# Altium schematic sheet LineSensors.SchDoc
size A; SheetNumber: roneV11-GyroAccel; SheetTotal: 6
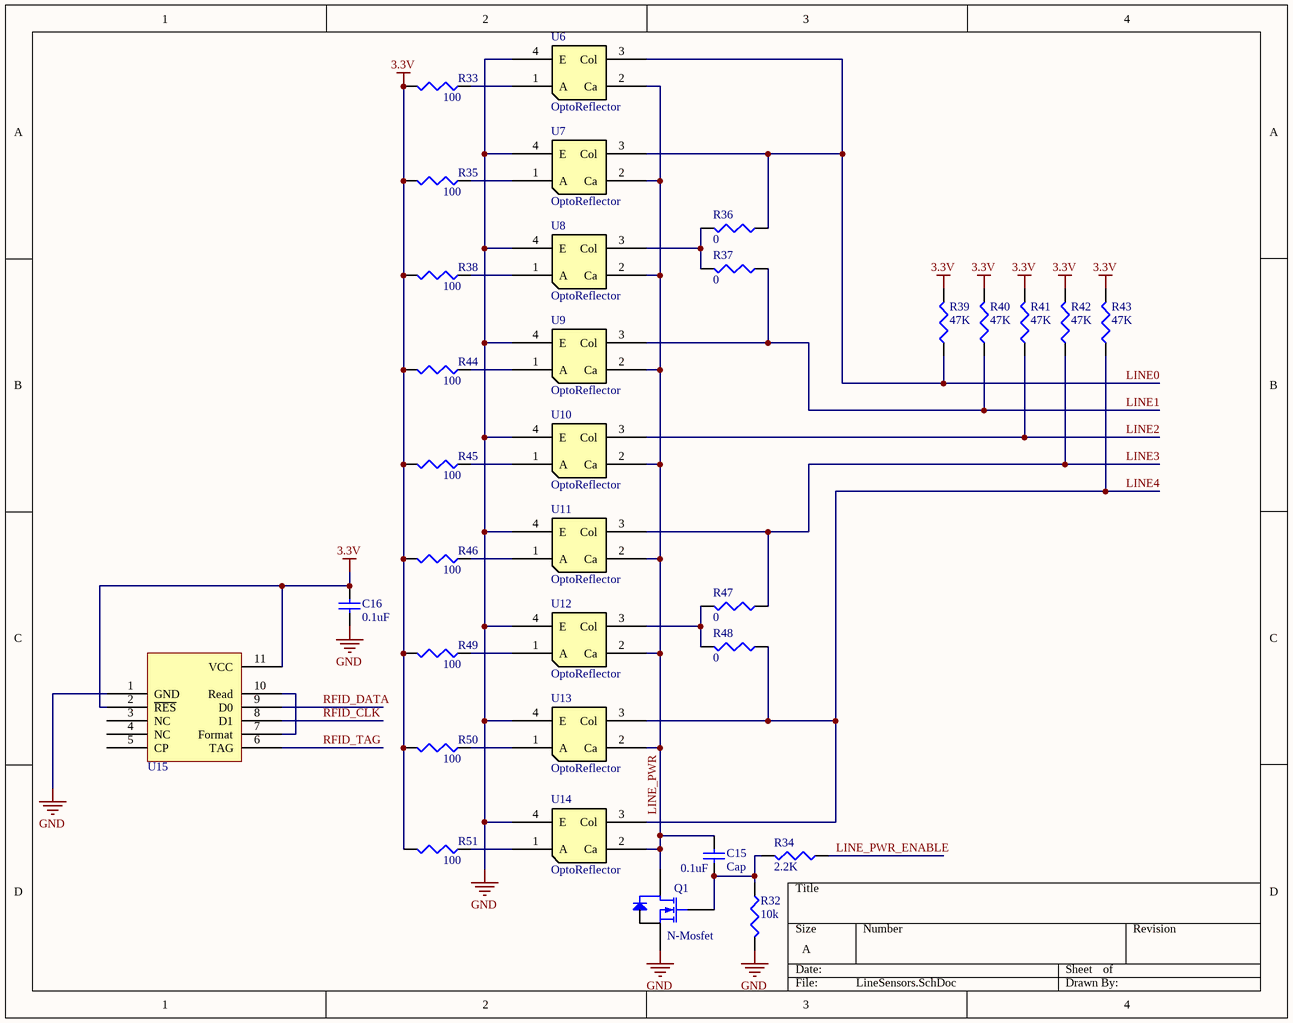
[diagram p0: LineSensors.SchDoc]

## Parts
C15  Cap  value 0.1uF  [CAPC1005L]
C16  value 0.1uF  [CAPC1005L]  (hidden comment: Cap Semi)
Q1  N-Mosfet  [SOT-23]
R32  value 10k  [J1-0603]  (hidden comment: Res3)
R33  value 100  [J1-0603]  (hidden comment: Res3)
R34  value 2.2K  [J1-0603]  (hidden comment: Res3)
R35  value 100  [J1-0603]  (hidden comment: Res3)
R36  value 0  [J1-0603]  (hidden comment: Res3)
R37  value 0  [J1-0603]  (hidden comment: Res3)
R38  value 100  [J1-0603]  (hidden comment: Res3)
R39  value 47K  [J1-0603]  (hidden comment: Res3)
R40  value 47K  [J1-0603]  (hidden comment: Res3)
R41  value 47K  [J1-0603]  (hidden comment: Res3)
R42  value 47K  [J1-0603]  (hidden comment: Res3)
R43  value 47K  [J1-0603]  (hidden comment: Res3)
R44  value 100  [J1-0603]  (hidden comment: Res3)
R45  value 100  [J1-0603]  (hidden comment: Res3)
R46  value 100  [J1-0603]  (hidden comment: Res3)
R47  value 0  [J1-0603]  (hidden comment: Res3)
R48  value 0  [J1-0603]  (hidden comment: Res3)
R49  value 100  [J1-0603]  (hidden comment: Res3)
R50  value 100  [J1-0603]  (hidden comment: Res3)
R51  value 100  [J1-0603]  (hidden comment: Res3)
U6  OptoReflector  [QRE1113]
U7  OptoReflector  [QRE1113]
U8  OptoReflector  [QRE1113]
U9  OptoReflector  [QRE1113]
U10  OptoReflector  [QRE1113]
U11  OptoReflector  [QRE1113]
U12  OptoReflector  [QRE1113]
U13  OptoReflector  [QRE1113]
U14  OptoReflector  [QRE1113]
U15  ID-12LA  [ID12-LA]  (value not drawn)

## Nets
3.3V: C16.2 R33.2 R35.2 R38.2 R39.2 R40.2 R41.2 R42.2 R43.2 R44.2 R45.2 R46.2 R49.2 R50.2 R51.2 U15.2(~{RES}) U15.11(VCC)
GND: C16.1 Q1.2(S) R32.1 U6.4(E) U7.4(E) U8.4(E) U9.4(E) U10.4(E) U11.4(E) U12.4(E) U13.4(E) U14.4(E) U15.1(GND)
LINE0: R36.1 R39.1 U6.3(Col) U7.3(Col)
LINE1: R37.1 R40.1 U9.3(Col)
LINE2: R41.1 U10.3(Col)
LINE3: R42.1 R47.1 U11.3(Col)
LINE4: R43.1 R48.1 U13.3(Col) U14.3(Col)
LINE_PWR: C15.1 Q1.3(D) U6.2(Ca) U7.2(Ca) U8.2(Ca) U9.2(Ca) U10.2(Ca) U11.2(Ca) U12.2(Ca) U13.2(Ca) U14.2(Ca)
LINE_PWR_ENABLE: R34.2
RFID_CLK: U15.8(D1)
RFID_DATA: U15.9(D0)
RFID_TAG: U15.6(TAG)
NetC15_2: C15.2 Q1.1(G) R32.2 R34.1
NetR33_1: R33.1 U6.1(A)
NetR35_1: R35.1 U7.1(A)
NetR36_2: R36.2 R37.2 U8.3(Col)
NetR38_1: R38.1 U8.1(A)
NetR44_1: R44.1 U9.1(A)
NetR45_1: R45.1 U10.1(A)
NetR46_1: R46.1 U11.1(A)
NetR47_2: R47.2 R48.2 U12.3(Col)
NetR49_1: R49.1 U12.1(A)
NetR50_1: R50.1 U13.1(A)
NetR51_1: R51.1 U14.1(A)
NetU15_7: U15.7(Format) U15.10(Read)

Not connected (* = marked no-connect by the designer): U15 3(NC) 4(NC) 5(CP)

## Library data of the parts
C15 = Cap: Capacitor; Published: 8-Jun-2000; LatestRevisionDate: 17-Jul-2002; LatestRevisionNote: Re-released for DXP Platform.; PackageReference: RAD-0.3; Publisher: Altium Limited
C16 = Cap Semi: Capacitor (Semiconductor SIM Model); Published: 8-Jun-2000; LatestRevisionDate: 29-May-2009; LatestRevisionNote: IPC-7351 Footprint Added.; PackageReference: C1206; Publisher: Altium Limited; PackageDescription: Chip Capacitor
R32-R51 = Res3: Resistor; Published: 8-Jun-2000; LatestRevisionDate: 29-May-2009; LatestRevisionNote: IPC-7351 Footprint Added.; PackageReference: J1-0603; Publisher: Altium Limited; PackageDescription: Chip Resistor
U6-U14 = QRE1113GR